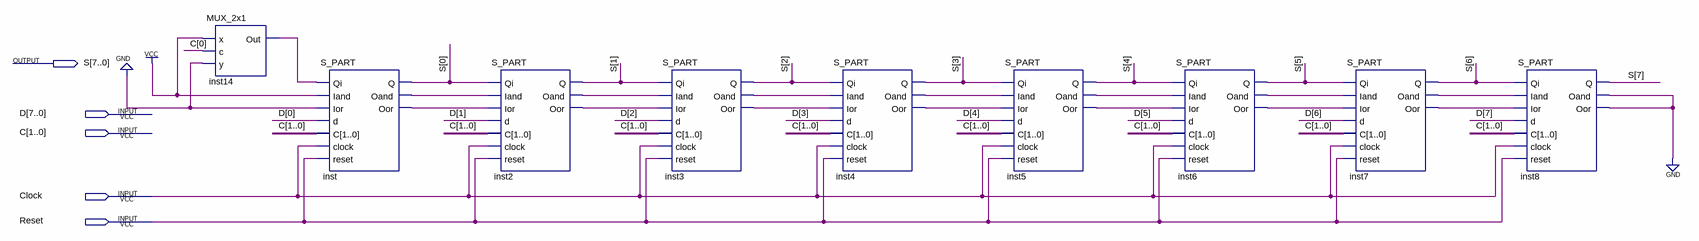
[diagram p0: schematic sheet]
// Quartus schematic S_COUNTER.bdf as structural Verilog: 9 symbols, 5 pins
module S_COUNTER (
  input  [7:0] D,
  input  [1:0] C,
  input  Clock,
  input  Reset,
  output [7:0] S
);

  wire inst2_oand, inst2_oor, inst3_oand, inst3_oor, inst4_oand, inst4_oor, inst5_oand, inst5_oor,
       inst6_oand, inst6_oor, inst7_oand, inst7_oor, inst8_oand, inst14_out, inst_oand, inst_oor;

  MUX_2x1 inst14 (.x(1'b1), .c(C[0]), .y(1'b0), .Out(inst14_out));
  S_PART inst (
    .Qi(inst14_out), .Iand(1'b1), .Ior(1'b0), .d(D[0]), .C(C), .clock(Clock), .reset(Reset), .Q(S[0]),
    .Oand(inst_oand), .Oor(inst_oor));
  S_PART inst2 (
    .Qi(S[0]), .Iand(inst_oand), .Ior(inst_oor), .d(D[1]), .C(C), .clock(Clock), .reset(Reset), .Q(S[1]),
    .Oand(inst2_oand), .Oor(inst2_oor));
  S_PART inst3 (
    .Qi(S[1]), .Iand(inst2_oand), .Ior(inst2_oor), .d(D[2]), .C(C), .clock(Clock), .reset(Reset), .Q(S[2]),
    .Oand(inst3_oand), .Oor(inst3_oor));
  S_PART inst4 (
    .Qi(S[2]), .Iand(inst3_oand), .Ior(inst3_oor), .d(D[3]), .C(C), .clock(Clock), .reset(Reset), .Q(S[3]),
    .Oand(inst4_oand), .Oor(inst4_oor));
  S_PART inst5 (
    .Qi(S[3]), .Iand(inst4_oand), .Ior(inst4_oor), .d(D[4]), .C(C), .clock(Clock), .reset(Reset), .Q(S[4]),
    .Oand(inst5_oand), .Oor(inst5_oor));
  S_PART inst6 (
    .Qi(S[4]), .Iand(inst5_oand), .Ior(inst5_oor), .d(D[5]), .C(C), .clock(Clock), .reset(Reset), .Q(S[5]),
    .Oand(inst6_oand), .Oor(inst6_oor));
  S_PART inst7 (
    .Qi(S[5]), .Iand(inst6_oand), .Ior(inst6_oor), .d(D[6]), .C(C), .clock(Clock), .reset(Reset), .Q(S[6]),
    .Oand(inst7_oand), .Oor(inst7_oor));
  S_PART inst8 (
    .Qi(S[6]), .Iand(inst7_oand), .Ior(inst7_oor), .d(D[7]), .C(C), .clock(Clock), .reset(Reset), .Q(S[7]),
    .Oand(inst8_oand), .Oor(inst8_oand));
  // also tied to GND on the sheet: inst8_oand
endmodule
